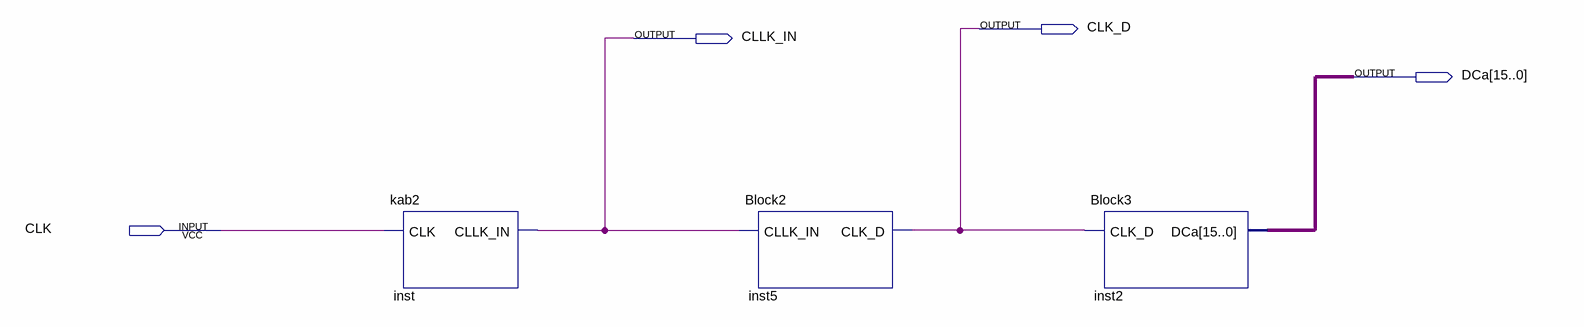
[diagram p0: schematic sheet]
// Quartus schematic main.bdf as structural Verilog: 3 symbols, 4 pins
module main (
  input  CLK,
  output CLK_D,
  output CLLK_IN,
  output [15:0] DCa
);

  kab2 inst (.CLK(CLK), .CLLK_IN(CLLK_IN));
  Block2 inst5 (.CLLK_IN(CLLK_IN), .CLK_D(CLK_D));
  Block3 inst2 (.CLK_D(CLK_D), .DCa(DCa));
endmodule
